# Altium project ICM-20689.PrjPcb
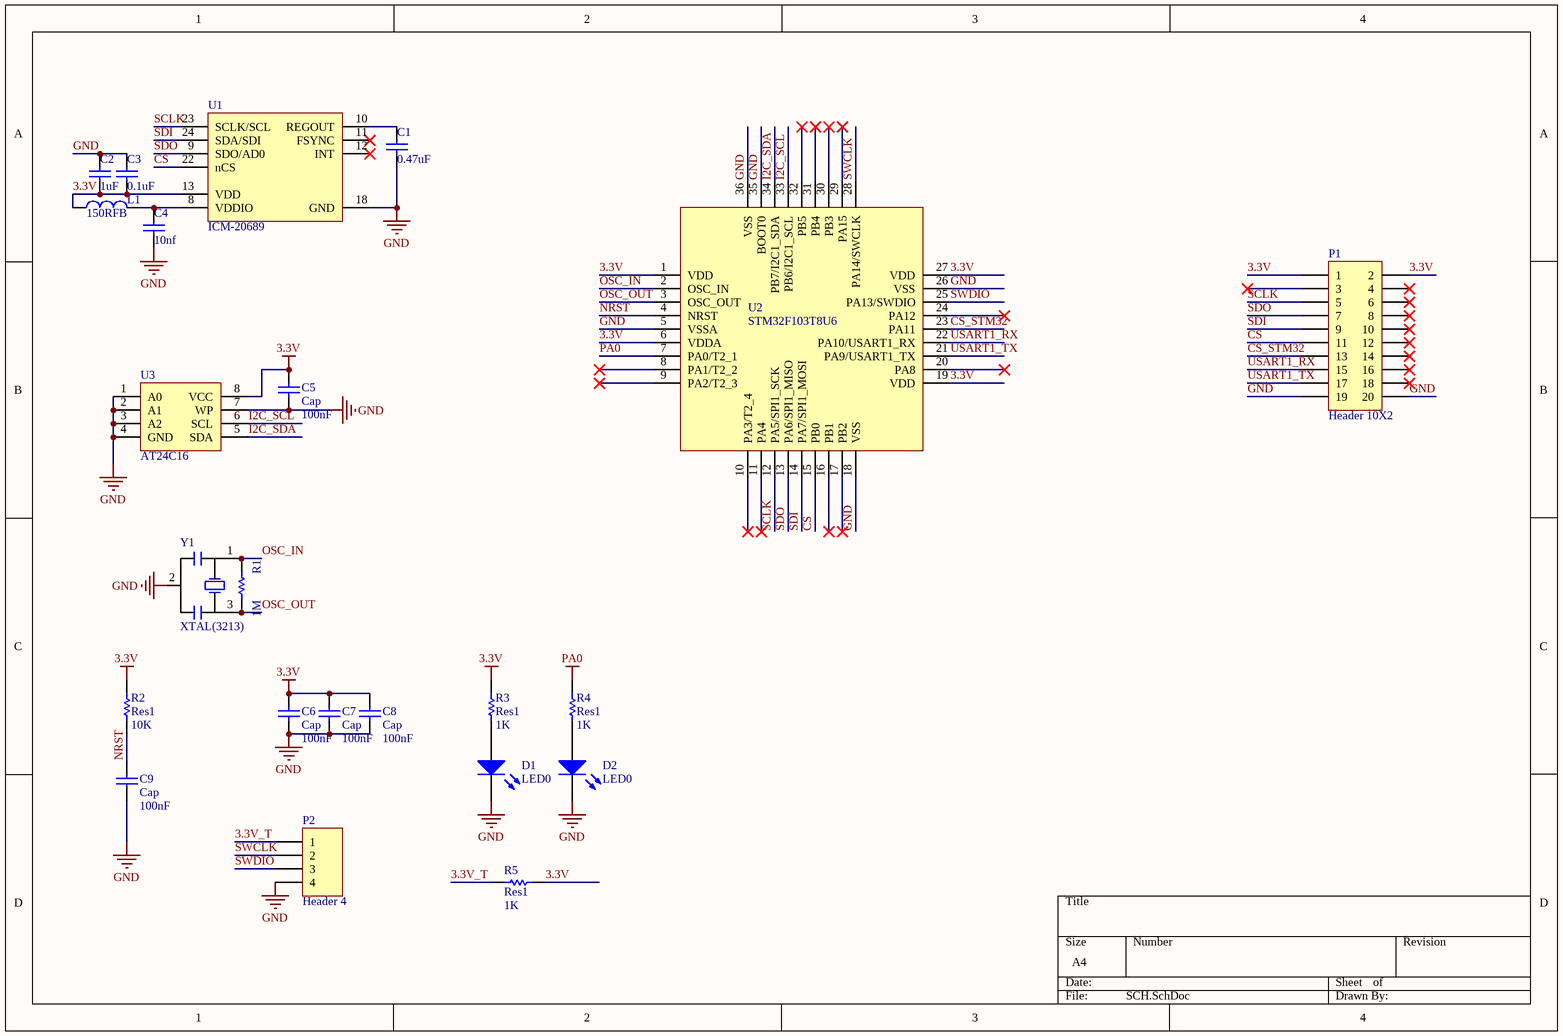
[diagram p0: SCH.SchDoc]
1 sheet, 23 parts. Net scope: global (net labels, ports and power ports of the same name join across sheets).
Board file: PCB.PcbDoc

## Sheet SCH.SchDoc
size A4

### Parts
C1  value 0.47uF  [c0603]  (hidden comment: Cap)
C2  value 1uF  [c0603]  (hidden comment: Cap)
C3  value 0.1uF  [c0603]  (hidden comment: Cap)
C4  value 10nf  [c0603]  (hidden comment: Cap)
C5  Cap  value 100nF  [C0603]
C6  Cap  value 100nF  [C0603]
C7  Cap  value 100nF  [C0603]
C8  Cap  value 100nF  [C0603]
C9  Cap  value 100nF  [C0603]
D1  LED0  [0603D]
D2  LED0  [0603D]
L1  value 150RFB  [r0603]  (hidden comment: Inductors)
P1  Header 10X2  [0.5_2x10P]
P2  Header 4  [1.0*4PIN/SMD H]
R1  value 1M  [R0603]  (hidden comment: Res1)
R2  Res1  value 10K  [R0603]
R3  Res1  value 1K  [R0603]
R4  Res1  value 1K  [R0603]
R5  Res1  value 1K  [R0603]
U1  ICM-20689  [QFN24]
U2  STM32F103T8U6  [VFQFPN36]
U3  AT24C16  [TSSOP8]
Y1  XTAL(3213)  [Y3213]

### Nets
3.3V: C2.1 C3.1 C5.2 C6.2 C7.2 C8.2 L1.1 P1.1 P1.2 R2.2 R3.2 R5.1 U1.13(VDD) U2.1(VDD) U2.6(VDDA) U2.19(VDD) U2.27(VDD) U3.8(VCC)
GND: C1.1 C2.2 C3.2 C4.1 C5.1 C6.1 C7.1 C8.1 C9.1 D1.2(K) D2.2(K) P1.19 P1.20 P2.4 U1.18(GND) U2.5(VSSA) U2.18(VSS) U2.26(VSS) U2.35(BOOT0) U2.36(VSS) U3.1(A0) U3.2(A1) U3.3(A2) U3.4(GND) U3.7(WP) Y1.2(GND)
PA0: R4.2 U2.7(PA0/T2_1)
3.3V_T: P2.1 R5.2
CS: P1.11 U1.22(nCS) U2.15(PB0)
CS_STM32: P1.13 U2.23(PA11)
I2C_SCL: U2.33(PB6/I2C1_SCL) U3.6(SCL)
I2C_SDA: U2.34(PB7/I2C1_SDA) U3.5(SDA)
NRST: C9.2 R2.1 U2.4(NRST)
OSC_IN: R1.2 U2.2(OSC_IN) Y1.1(OSC1)
OSC_OUT: R1.1 U2.3(OSC_OUT) Y1.3(OSC2)
SCLK: P1.5 U1.23(SCLK/SCL) U2.12(PA5/SPI1_SCK)
SDI: P1.9 U1.24(SDA/SDI) U2.14(PA7/SPI1_MOSI)
SDO: P1.7 U1.9(SDO/AD0) U2.13(PA6/SPI1_MISO)
SWCLK: P2.2 U2.28(PA14/SWCLK)
SWDIO: P2.3 U2.25(PA13/SWDIO)
USART1_RX: P1.15 U2.22(PA10/USART1_RX)
USART1_TX: P1.17 U2.21(PA9/USART1_TX)
NetC1_2: C1.2 U1.10(REGOUT)
NetC4_2: C4.2 L1.2 U1.8(VDDIO)
NetD1_1: D1.1(A) R3.1
NetD2_1: D2.1(A) R4.1

Not connected (* = marked no-connect by the designer): P1 3* 4* 6* 8* 10* 12* 14* 16* 18*; U1 11(FSYNC)* 12(INT)*; U2 8(PA1/T2_2)* 9(PA2/T2_3)* 10(PA3/T2_4)* 11(PA4)* 16(PB1)* 17(PB2)* 20(PA8)* 24(PA12)* 29(PA15)* 30(PB3)* 31(PB4)* 32(PB5)*

### Library data of the parts
C1-C9 = Cap: Capacitor; Published: 8-Jun-2000; LatestRevisionDate: 17-Jul-2002; LatestRevisionNote: Re-released for DXP Platform.; PackageReference: RAD-0.3; Publisher: Altium Limited
  C1-C4: PackageDescription: Radial Cap, Thru-Hole; 2 Leads; 0.3 in Pin Spacing
D1 D2 = LED0: Typical INFRARED GaAs LED; Published: 8-Jun-2000; LatestRevisionDate: 08-Jul-2005; LatestRevisionNote: Mech Layer 1 removed.; PackageReference: LED-0; Publisher: Altium Limited; PackageDescription: LED; 2 Leads
P1 = Header 10X2: Header, 10-Pin, Dual row; LatestRevisionDate: 17-Jul-2002; LatestRevisionNote: Re-released for DXP Platform.; Publisher: Altium Limited
P2 = Header 4: Header, 4-Pin; LatestRevisionDate: 17-Jul-2002; LatestRevisionNote: Re-released for DXP Platform.; Publisher: Altium Limited
R1-R5 = Res1: Resistor; Published: 8-Jun-2000; LatestRevisionDate: 17-Jul-2002; LatestRevisionNote: Re-released for DXP Platform.; PackageReference: AXIAL-0.3; Publisher: Altium Limited; PackageDescription: Axial Device, Thru-Hole; 2 Leads; 0.3 in Pin Spacing
Y1 = XTAL(3213): Crystal Oscillator; Published: 8-Jun-2000; LatestRevisionDate: 17-Jul-2002; LatestRevisionNote: Re-released for DXP Platform.; PackageReference: R38; Publisher: Altium Limited